# EAGLE schematic PandaBoard_Shell (EAGLE 6.1)
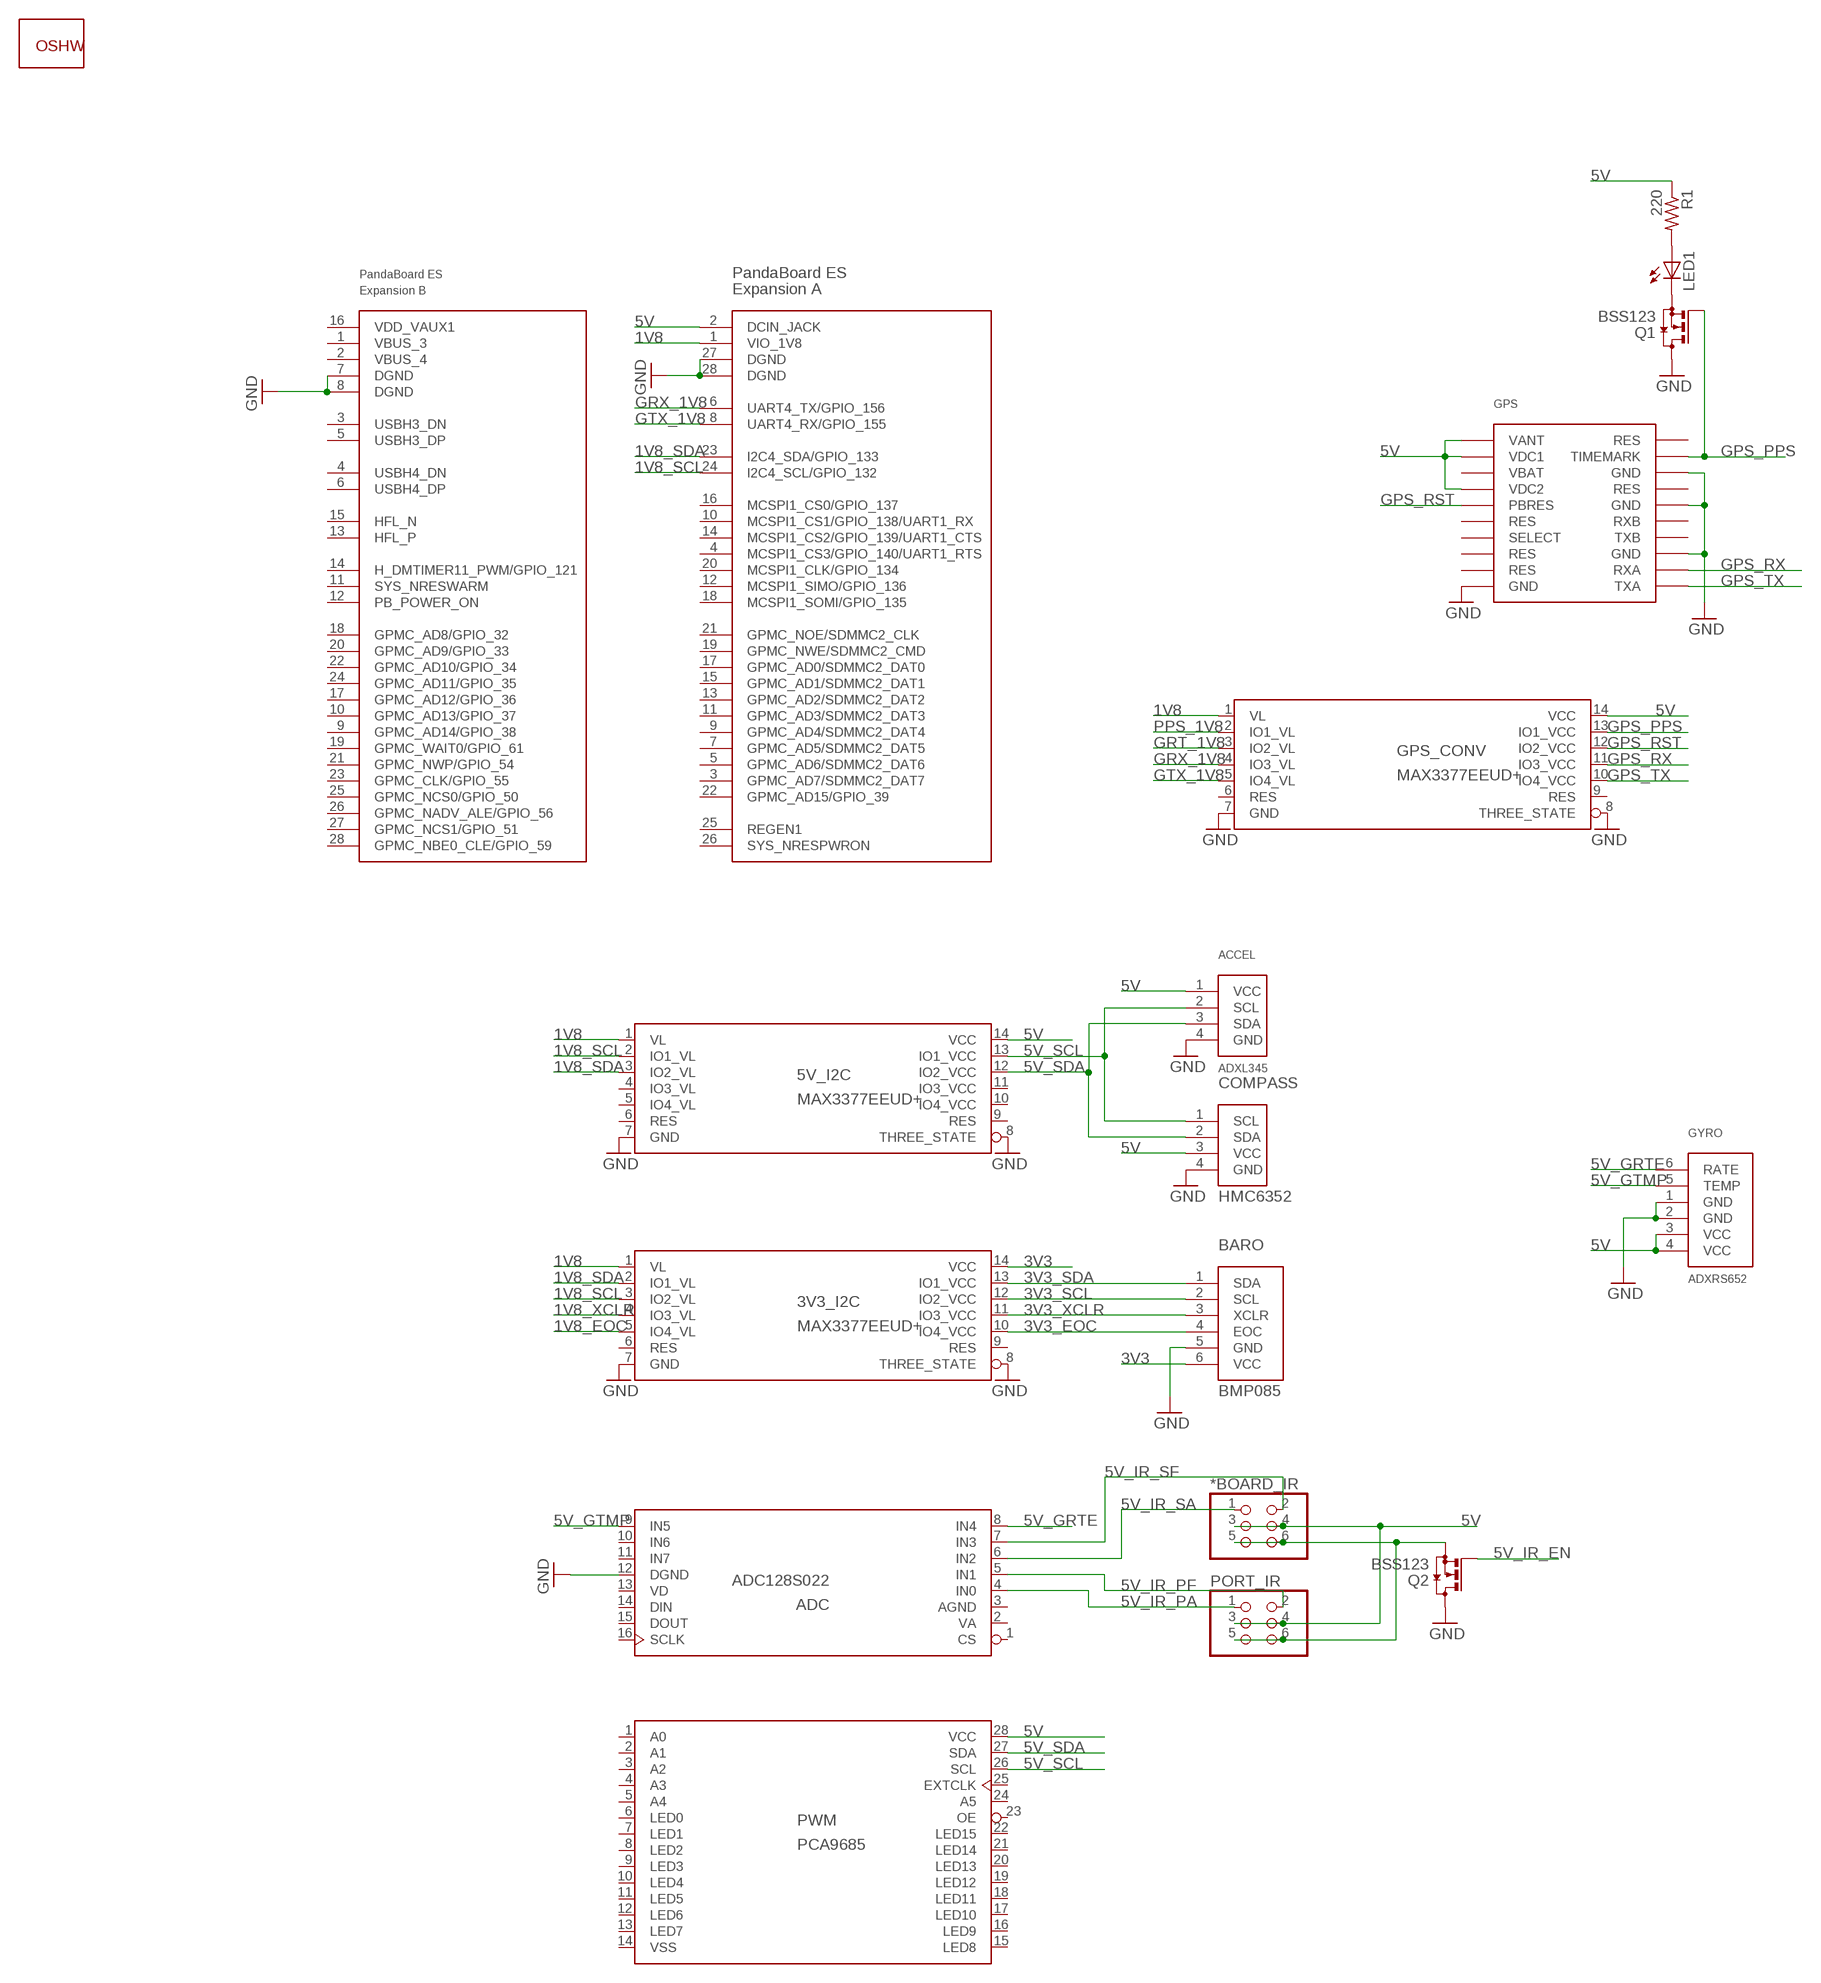
[diagram p0: schematic, sheet 1]

## Parts
3V3_I2C  MAX3377EEUD+  [MAX3377EEUD+]
5V_I2C  MAX3377EEUD+  [MAX3377EEUD+]
*BOARD_IR  PINHD-2X3  [2X03]
ACCEL  ADXL345  [ADXL345]
ADC  ADC128S022  [ADC128S022]
BARO  BMP085  [6-PIN_0.1"]
COMPASS  HMC6352  [HMC6352]
GOLD_ORB_SM1  OSHWLOGO_GOLD_ORB_SM  [OSHW2]
GPS  ET-102_V2.0  [10X2_HEADER]
GPS_CONV  MAX3377EEUD+  [MAX3377EEUD+]
GYRO  ADXRS652  [ADXRS652]
LED1  LEDCHIPLED_0805  [CHIPLED_0805]
PORT_IR  PINHD-2X3  [2X03]
PWM  PCA9685  [PCA9685]
Q1  BSS123  [SOT23]
Q2  BSS123  [SOT23]
R1  220  R-US_R0603  [R0603]
U$1  PES_EXP_A  [28-PIN_0.1"]
U$2  PES_EXP_B  [28-PIN_0.1"]

## Nets
1V8: 3V3_I2C.1(VL) 5V_I2C.1(VL) GPS_CONV.1(VL) U$1.1(VIO_1V8)
1V8_EOC: 3V3_I2C.5(IO4_VL)
1V8_SCL: 3V3_I2C.3(IO2_VL) 5V_I2C.2(IO1_VL) U$1.24(I2C4_SCL/GPIO_132)
1V8_SDA: 3V3_I2C.2(IO1_VL) 5V_I2C.3(IO2_VL) U$1.23(I2C4_SDA/GPIO_133)
1V8_XCLR: 3V3_I2C.4(IO3_VL)
3V3: 3V3_I2C.14(VCC) BARO.6(VCC)
3V3_EOC: 3V3_I2C.10(IO4_VCC) BARO.4(EOC)
3V3_SCL: 3V3_I2C.12(IO2_VCC) BARO.2(SCL)
3V3_SDA: 3V3_I2C.13(IO1_VCC) BARO.1(SDA)
3V3_XCLR: 3V3_I2C.11(IO3_VCC) BARO.3(XCLR)
5V: 5V_I2C.14(VCC) *BOARD_IR.3 *BOARD_IR.4 ACCEL.1(VCC) COMPASS.3(VCC) GPS.P$1(VANT) GPS.P$2(VDC1) GPS.P$4(VDC2) GPS_CONV.14(VCC) GYRO.3(VCC) GYRO.4(VCC) PORT_IR.3 PORT_IR.4 PWM.28(VCC) R1.1 U$1.2(DCIN_JACK)
5V_GRTE: ADC.8(IN4) GYRO.6(RATE)
5V_GTMP: ADC.9(IN5) GYRO.5(TEMP)
5V_IR_EN: Q2.1(G)
5V_IR_PA: ADC.4(IN0) PORT_IR.1
5V_IR_PF: ADC.5(IN1) PORT_IR.2
5V_IR_SA: *BOARD_IR.1 ADC.6(IN2)
5V_IR_SF: *BOARD_IR.2 ADC.7(IN3)
5V_SCL: 5V_I2C.13(IO1_VCC) ACCEL.2(SCL) COMPASS.1(SCL) PWM.26(SCL)
5V_SDA: 5V_I2C.12(IO2_VCC) ACCEL.3(SDA) COMPASS.2(SDA) PWM.27(SDA)
GND: 3V3_I2C.7(GND) 3V3_I2C.8(THREE_STATE) 5V_I2C.7(GND) 5V_I2C.8(THREE_STATE) ACCEL.4(GND) ADC.12(DGND) BARO.5(GND) COMPASS.4(GND) GPS.P$10(GND) GPS.P$13(GND) GPS.P$16(GND) GPS.P$18(GND) GPS_CONV.7(GND) GPS_CONV.8(THREE_STATE) GYRO.1(GND) GYRO.2(GND) Q1.3(D) Q2.3(D) U$1.27(DGND) U$1.28(DGND) U$2.7(DGND) U$2.8(DGND)
GPS_PPS: GPS.P$19(TIMEMARK) GPS_CONV.13(IO1_VCC) Q1.1(G)
GPS_RST: GPS.P$5(PBRES) GPS_CONV.12(IO2_VCC)
GPS_RX: GPS.P$12(RXA) GPS_CONV.11(IO3_VCC)
GPS_TX: GPS.P$11(TXA) GPS_CONV.10(IO4_VCC)
GRT_1V8: GPS_CONV.3(IO2_VL)
GRX_1V8: GPS_CONV.4(IO3_VL) U$1.6(UART4_TX/GPIO_156)
GTX_1V8: GPS_CONV.5(IO4_VL) U$1.8(UART4_RX/GPIO_155)
N$7: LED1.C Q1.2(S)
N$8: LED1.A R1.2
PPS_1V8: GPS_CONV.2(IO1_VL)
SHARP_GND: *BOARD_IR.5 *BOARD_IR.6 PORT_IR.5 PORT_IR.6 Q2.2(S)
Unconnected: 3V3_I2C.6(RES) 3V3_I2C.9(RES) 5V_I2C.4(IO3_VL) 5V_I2C.5(IO4_VL) 5V_I2C.6(RES) 5V_I2C.9(RES) 5V_I2C.10(IO4_VCC) 5V_I2C.11(IO3_VCC) ADC.1(CS) ADC.10(IN6) ADC.11(IN7) ADC.14(DIN) ADC.15(DOUT) ADC.16(SCLK) GPS.P$6(RES) GPS.P$7(SELECT) GPS.P$8(RES) GPS.P$9(RES) GPS.P$14(TXB) GPS.P$15(RXB) GPS.P$17(RES) GPS.P$20(RES) GPS_CONV.6(RES) GPS_CONV.9(RES) PWM.1(A0) PWM.2(A1) PWM.3(A2) PWM.4(A3) PWM.5(A4) PWM.6(LED0) PWM.7(LED1) PWM.8(LED2) PWM.9(LED3) PWM.10(LED4) PWM.11(LED5) PWM.12(LED6) PWM.13(LED7) PWM.15(LED8) PWM.16(LED9) PWM.17(LED10) PWM.18(LED11) PWM.19(LED12) PWM.20(LED13) PWM.21(LED14) PWM.22(LED15) PWM.23(OE) PWM.24(A5) PWM.25(EXTCLK) U$1.3(GPMC_AD7/SDMMC2_DAT7) U$1.4(MCSPI1_CS3/GPIO_140/UART1_RTS) U$1.5(GPMC_AD6/SDMMC2_DAT6) U$1.7(GPMC_AD5/SDMMC2_DAT5) U$1.9(GPMC_AD4/SDMMC2_DAT4) U$1.10(MCSPI1_CS1/GPIO_138/UART1_RX) U$1.11(GPMC_AD3/SDMMC2_DAT3) U$1.12(MCSPI1_SIMO/GPIO_136) U$1.13(GPMC_AD2/SDMMC2_DAT2) U$1.14(MCSPI1_CS2/GPIO_139/UART1_CTS) U$1.15(GPMC_AD1/SDMMC2_DAT1) U$1.16(MCSPI1_CS0/GPIO_137) U$1.17(GPMC_AD0/SDMMC2_DAT0) U$1.18(MCSPI1_SOMI/GPIO_135) U$1.19(GPMC_NWE/SDMMC2_CMD) U$1.20(MCSPI1_CLK/GPIO_134) U$1.21(GPMC_NOE/SDMMC2_CLK) U$1.22(GPMC_AD15/GPIO_39) U$1.25(REGEN1) U$1.26(SYS_NRESPWRON) U$2.1(VBUS_3) U$2.2(VBUS_4) U$2.3(USBH3_DN) U$2.4(USBH4_DN) U$2.5(USBH3_DP) U$2.6(USBH4_DP) U$2.9(GPMC_AD14/GPIO_38) U$2.10(GPMC_AD13/GPIO_37) U$2.11(SYS_NRESWARM) U$2.12(PB_POWER_ON) U$2.13(HFL_P) U$2.14(H_DMTIMER11_PWM/GPIO_121) U$2.15(HFL_N) U$2.16(VDD_VAUX1) U$2.17(GPMC_AD12/GPIO_36) U$2.18(GPMC_AD8/GPIO_32) U$2.19(GPMC_WAIT0/GPIO_61) U$2.20(GPMC_AD9/GPIO_33) U$2.21(GPMC_NWP/GPIO_54) U$2.22(GPMC_AD10/GPIO_34) U$2.23(GPMC_CLK/GPIO_55) U$2.24(GPMC_AD11/GPIO_35) U$2.25(GPMC_NCS0/GPIO_50) U$2.26(GPMC_NADV_ALE/GPIO_56) U$2.27(GPMC_NCS1/GPIO_51) U$2.28(GPMC_NBE0_CLE/GPIO_59)

## Power pins joined to a net without a drawn wire
AGND: ADC.3(AGND)
VA: ADC.2(VA)
VBAT: GPS.P$3(VBAT)
VD: ADC.13(VD)
VSS: PWM.14(VSS)

## Library data of the parts
3V3_I2C 5V_I2C GPS_CONV = inanna:MAX3377EEUD+: MAX3377EEUD+ 4-bit bidirectional level converter
*BOARD_IR PORT_IR = SparkFun:PINHD-2X3: PIN HEADER
ACCEL = inanna:ADXL345: FRC ADXL345 board, I2C
ADC = inanna:ADC128S022: ADC128S022 8-channel 12-bit SPI ADC
BARO = inanna:BMP085: BMP085 barometric pressure sensor Sparkfun SEN-09694
COMPASS = inanna:HMC6352: HMC6352 2-axis compass Sparkfun SEN-07915
GOLD_ORB_SM1 = NBitWonder:OSHWLOGO: These are Open-Source Hardware logos.
GPS = custom_library:ET-102_V2.0
GYRO = inanna:ADXRS652: FRC ADXRS652 board
LED1 = led:LED: LED OSRAM: - CHIPLED LG R971, LG N971, LY N971, LG Q971, LY Q971, LO R971, LY R971 LH N974, LH R974 LS Q976, LO Q976, LY Q976 LO Q996 - Hyper CHIPLED LW Q18S LB Q993, LB Q99A, LB R99A - SideLED LS A670, LO A670, LY A670, LG A670, LP A670 LB A673, LV A673, LT A673, LW A673 LH A674 LY A675 LS A676, LA A676, LO A676, LY A676, LW A676 LS A679, LY A679, LG A679 - Hyper Micro SIDELED® LS Y876, LA Y876, LO Y876, LY Y876 LT Y87S - SmartLED LW L88C, LW L88S LB L89C, LB L89S, LG L890 LS L89K, LO L89K, LY L89K LS L896, LA L896, LO L896, LY L896 - TOPLED LS T670, LO T670, LY T670, LG T670, LP T670 LSG T670, LSP T670, LSY T670, LOP T670, LYG T670 LG T671, LOG T671, LSG T671 LB T673, LV T673, LT T673, LW T673 LH T674 LS T676, LA T676, LO T676, LY T676, LB T676, LH T676, LSB T676, LW T676 LB T67C, LV T67C, LT T67C, LS T67K, LO T67K, LY T67K, LW E67C LS E67B, LA E67B, LO E67B, LY E67B, LB E67C, LV E67C, LT E67C LW T67C LS T679, LY T679, LG T679 LS T770, LO T770, LY T770, LG T770, LP T770 LB T773, LV T773, LT T773, LW T773 LH T774 LS E675, LA E675, LY E675, LS T675 LS T776, LA T776, LO T776, LY T776, LB T776 LHGB T686 LT T68C, LB T68C - Hyper Mini TOPLED® LB M676 - Mini TOPLED Santana® LG M470 LS M47K, LO M47K, LY M47K Source: http://www.osram.convergy.de LUXEON: - LUMILED® LXK2-PW12-R00, LXK2-PW12-S00, LXK2-PW14-U00, LXK2-PW14-V00 LXK2-PM12-R00, LXK2-PM12-S00, LXK2-PM14-U00 LXK2-PE12-Q00, LXK2-PE12-R00, LXK2-PE12-S00, LXK2-PE14-T00, LXK2-PE14-U00 LXK2-PB12-K00, LXK2-PB12-L00, LXK2-PB12-M00, LXK2-PB14-N00, LXK2-PB14-P00, LXK2-PB14-Q00 LXK2-PR12-L00, LXK2-PR12-M00, LXK2-PR14-Q00, LXK2-PR14-R00 LXK2-PD12-Q00, LXK2-PD12-R00, LXK2-PD12-S00 LXK2-PH12-R00, LXK2-PH12-S00 LXK2-PL12-P00, LXK2-PL12-Q00, LXK2-PL12-R00 Source: www.luxeon.com KINGBRIGHT: KA-3528ASYC Source: www.kingbright.com
PWM = inanna:PCA9685: PCA9685 16-channel 12-bit I2C PWM slave
Q1 Q2 = transistor-small-signal:BSS123: N-CHANNEL MOS FET
R1 = resistor:R-US_: RESISTOR, American symbol
U$1 = inanna:PES_EXP_A: Expansion Header A for the PandaBoard ES
U$2 = inanna:PES_EXP_B: Expansion Header B on PandaBoard ES